# Altium project SAMA5D27-SOM1-EK1_ REVD1.PrjPcb (part 5 of 6)

## Sheet 08) Ethernet & USB.SchDoc
size B; CompanyName: Microchip Technology Inc.; Organization: Microchip Technology; Address1: 2355 West Chandler Blvd.; Address2: Chandler, AZ  85224; Address4: USA; DocumentNumber: 8; SheetNumber: 8; SheetTotal: 9; SheetTitle: **; Time: Time
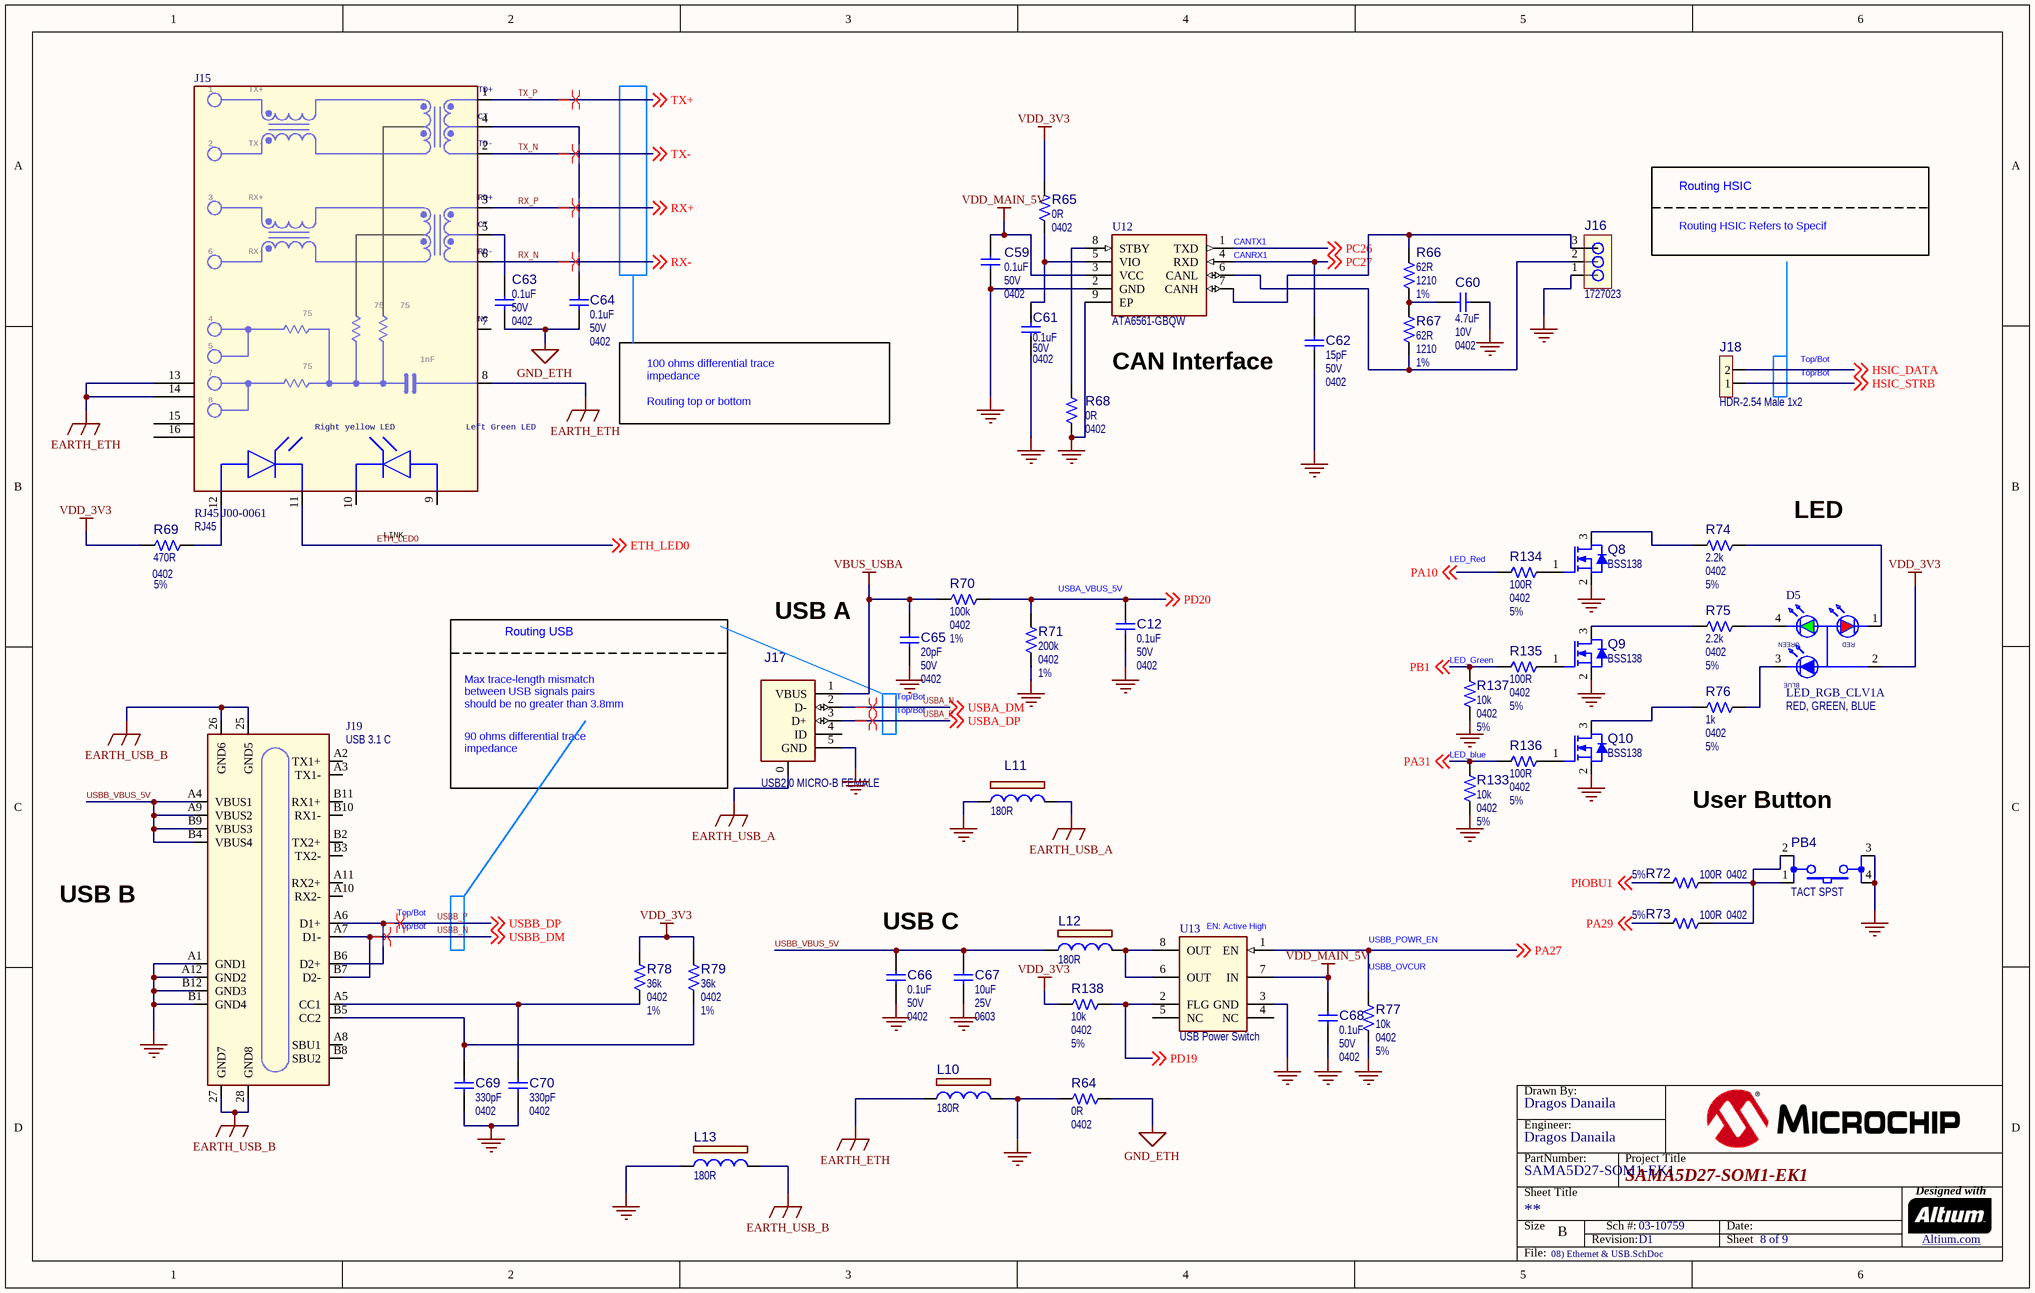
[diagram p7: 08) Ethernet & USB.SchDoc]

### Parts
(Parts that share a designator on the sheet are numbered #1, #2 ... from top to bottom, then left to right.)
?#8  (no value)  (graphical)
C12  value 0.1uF  Voltage: 50V  Package: 0402  [CAP_C_0402]  (hidden comment: Capacitor NP)
C59  value 0.1uF  Voltage: 50V  Package: 0402  [CAP_C_0402]  (hidden comment: Capacitor NP)
C60  value 4.7uF  Voltage: 10V  Package: 0402  [CAP_C_0402]  (hidden comment: Capacitor NP)
C61  value 0.1uF  Voltage: 50V  Package: 0402  [CAP_C_0402]  (hidden comment: Capacitor NP)
C62  value 15pF  Voltage: 50V  Package: 0402  [CAP_C_0402]  (hidden comment: Capacitor NP)
C63  value 0.1uF  Voltage: 50V  Package: 0402  [CAP_C_0402]  (hidden comment: Capacitor NP)
C64  value 0.1uF  Voltage: 50V  Package: 0402  [CAP_C_0402]  (hidden comment: Capacitor NP)
C65  value 20pF  Voltage: 50V  Package: 0402  [CAP_C_0402]  (hidden comment: Capacitor NP)
C66  value 0.1uF  Voltage: 50V  Package: 0402  [CAP_C_0402]  (hidden comment: Capacitor NP)
C67  value 10uF  Voltage: 25V  Package: 0603  [CAP_C_0603]  (hidden comment: Capacitor NP)
C68  value 0.1uF  Voltage: 50V  Package: 0402  [CAP_C_0402]  (hidden comment: Capacitor NP)
C69  value 330pF  Package: 0402  [CAP_C_0402]  (hidden comment: Capacitor NP)
C70  value 330pF  Package: 0402  [CAP_C_0402]  (hidden comment: Capacitor NP)
D5  LED_RGB_CLV1A  value RED, GREEN, BLUE  [PLCC-4_CLV1A-FKB]
J15  RJ45 J00-0061  value RJ45  [J00-0061NL_RJ45_connector]
J16  value 1727023  [CON_TERMINAL_3.81_1x3_TH_RA_PHO_1727023]  (hidden comment: CON TERM BLK 1x3 TH Mount)
J17  value USB2.0 MICRO-B FEMALE  [CON_USB_Micro-AB_SMD_TH_RA_FCI_10118194-0001LF]  (hidden comment: CON USB2.0 Mini_Micro)
J18  value HDR-2.54 Male 1x2  [HDR_M_2.54_1x2]  (hidden comment: Header 1x2)
J19  value USB 3.1 C  [CON USB3.1-C Female SMD RA 1054500101]  (hidden comment: CON USB3.1-C Female SMD RA)
L10  value 180R  [IND_C_0603]  (hidden comment: Ferrite Bead)
L11  value 180R  [IND_C_0603]  (hidden comment: Ferrite Bead)
L12  value 180R  [IND_C_0603]  (hidden comment: Ferrite Bead)
L13  value 180R  [IND_C_0603]  (hidden comment: Ferrite Bead)
PB4  value TACT SPST  [SW_SMD_6mmX6mm_TL3301]  (hidden comment: Switch 4 Pin)
Q8  value BSS138  [SOT-23-3]  (hidden comment: Transistor MOS-N GSD)
Q9  value BSS138  [SOT-23-3]  (hidden comment: Transistor MOS-N GSD)
Q10  value BSS138  [SOT-23-3]  (hidden comment: Transistor MOS-N GSD)
R64  value 0R  Package: 0402  [RES_C_0402]  (hidden comment: Resistor)
R65  value 0R  Package: 0402  [RES_C_0402]  (hidden comment: Resistor)
R66  value 62R  Package: 1210  Tolerance: 1%  [RES_C_1210]  (hidden comment: Resistor)
R67  value 62R  Package: 1210  Tolerance: 1%  [RES_C_1210]  (hidden comment: Resistor)
R68  value 0R  Package: 0402  [RES_C_0402]  (hidden comment: Resistor)
R69  value 470R  Package: 0402  Tolerance: 5%  [RES_C_0402]  (hidden comment: Resistor)
R70  value 100k  Package: 0402  Tolerance: 1%  [RES_C_0402]  (hidden comment: Resistor)
R71  value 200k  Package: 0402  Tolerance: 1%  [RES_C_0402]  (hidden comment: Resistor)
R72  value 100R  Package: 0402  Tolerance: 5%  [RES_C_0402]  (hidden comment: Resistor)
R73  value 100R  Package: 0402  Tolerance: 5%  [RES_C_0402]  (hidden comment: Resistor)
R74  value 2.2k  Package: 0402  Tolerance: 5%  [RES_C_0402]  (hidden comment: Resistor)
R75  value 2.2k  Package: 0402  Tolerance: 5%  [RES_C_0402]  (hidden comment: Resistor)
R76  value 1k  Package: 0402  Tolerance: 5%  [RES_C_0402]  (hidden comment: Resistor)
R77  value 10k  Package: 0402  Tolerance: 5%  [RES_C_0402]  (hidden comment: Resistor)
R78  value 36k  Package: 0402  Tolerance: 1%  [RES_C_0402]  (hidden comment: Resistor)
R79  value 36k  Package: 0402  Tolerance: 1%  [RES_C_0402]  (hidden comment: Resistor)
R133  value 10k  Package: 0402  Tolerance: 5%  [RES_C_0402]  (hidden comment: Resistor)
R134  value 100R  Package: 0402  Tolerance: 5%  [RES_C_0402]  (hidden comment: Resistor)
R135  value 100R  Package: 0402  Tolerance: 5%  [RES_C_0402]  (hidden comment: Resistor)
R136  value 100R  Package: 0402  Tolerance: 5%  [RES_C_0402]  (hidden comment: Resistor)
R137  value 10k  Package: 0402  Tolerance: 5%  [RES_C_0402]  (hidden comment: Resistor)
R138  value 10k  Package: 0402  Tolerance: 5%  [RES_C_0402]  (hidden comment: Resistor)
U12  value ATA6561-GBQW  [DFN-8_3x3_EP2.4X1.55]  (hidden comment: ATA6561 VDFN-8)
U13  value USB Power Switch  [SOIC-8]  (hidden comment: MCHP ANALOG POWER SWITCH 5.5V 0.7A MIC2025-1YM SOIC8)

### Nets
EARTH_ETH: J15.8(P8) J15.13(P13) J15.14(P14) L10.1
EARTH_USB_A: J17.0(SHLD) L11.2
EARTH_USB_B: J19.25(GND5) J19.26(GND6) J19.27(GND7) J19.28(GND8) L13.2
GND_ETH: C63.2 C64.2 R64.2
GND_POWER: C12.2 C59.2 C60.2 C61.2 C62.2 C65.2 C66.2 C67.2 C68.2 C69.2 C70.2 J16.1 J17.5(GND) J19.A1(GND1) J19.A12(GND2) J19.B1(GND4) J19.B12(GND3) L10.2 L11.1 L13.1 PB4.3 PB4.4 Q8.2(S) Q9.2(S) Q10.2(S) R64.1 R68.2 R71.2 R77.2 R133.2 R137.2 U12.2(GND) U12.9(EP) U13.3(GND)  [project net GND]
VBUS_USBA: C65.1 J17.1(VBUS) R70.1
VDD_3V3: D5.2(A) R65.1 R69.1 R78.1 R79.1 R138.1
VDD_MAIN_5V: C59.1 C68.1 U12.3(VCC) U13.7(IN)
ETH_LED0: J15.11(P11) ; off-sheet ETH_LED0
HSIC_DATA: J18.2 ; off-sheet HSIC_DATA
HSIC_STRB: J18.1 ; off-sheet HSIC_STRB
PA10: R134.1 ; off-sheet PA10
PA27: R77.1 U13.1(EN) ; off-sheet PA27
PA29: R73.1 ; off-sheet PA29
PA31: R133.1 R136.1 ; off-sheet PA31
PB1: R135.1 R137.1 ; off-sheet PB1
PC26: U12.1(TXD) ; off-sheet PC26
PC27: C62.1 U12.4(RXD) ; off-sheet PC27
PD19: R138.2 U13.2(FLG) ; off-sheet PD19
PD20: C12.1 R70.2 R71.1 ; off-sheet PD20
PIOBU1: R72.1 ; off-sheet PIOBU1
RX_N: J15.6(P6) ; off-sheet RX-  [also labelled RX-]
RX_P: J15.3(P3) ; off-sheet RX+  [also labelled RX+]
TX_N: J15.2(P2) ; off-sheet TX-  [also labelled TX-]
TX_P: J15.1(P1) ; off-sheet TX+  [also labelled TX+]
USBA_N: J17.2(D-) ; off-sheet USBA_DM  [also labelled USBA_DM]
USBA_P: J17.3(D+) ; off-sheet USBA_DP  [also labelled USBA_DP]
USBB_N: J19.A7(D1-) J19.B7(D2-) ; off-sheet USBB_DM  [also labelled USBB_DM]
USBB_P: J19.A6(D1+) J19.B6(D2+) ; off-sheet USBB_DP  [also labelled USBB_DP]
USBB_VBUS_5V: C66.1 C67.1 J19.A4(VBUS1) J19.A9(VBUS2) J19.B4(VBUS4) J19.B9(VBUS3) L12.1
NetC60_1: C60.1 R66.2 R67.1
NetC61_1: C61.1 R65.2 U12.5(VIO)
NetC63_1: C63.1 J15.5(P5)
NetC64_1: C64.1 J15.4(P4)
NetC69_1: C69.1 J19.B5(CC2) R79.2
NetC70_1: C70.1 J19.A5(CC1) R78.2
NetD5_1: D5.1(K1) R74.2
NetD5_3: D5.3(K3) R76.2
NetD5_4: D5.4(K2) R75.2
NetJ15_12: J15.12(P12) R69.2
NetJ16_2: J16.2 R67.2 U12.6(CANL)
NetJ16_3: J16.3 R66.1 U12.7(CANH)
NetL12_2: L12.2 U13.6(OUT) U13.8(OUT)
NetPB4_1: PB4.1 PB4.2 R72.2 R73.2
NetQ8_1: Q8.1(G) R134.2
NetQ8_3: Q8.3(D) R74.1
NetQ9_1: Q9.1(G) R135.2
NetQ9_3: Q9.3(D) R75.1
NetQ10_1: Q10.1(G) R136.2
NetQ10_3: Q10.3(D) R76.1
NetR68_1: R68.1 U12.8(STBY)

Not connected (* = marked no-connect by the designer): J15 7(P7) 9(P9) 10(P10) 15(P15) 16(P16); J17 4(ID); J19 A2(TX1+) A3(TX1-) A8(SBU1) A10(RX2-) A11(RX2+) B2(TX2+) B3(TX2-) B8(SBU2) B10(RX1-) B11(RX1+); U13 4(NC) 5(NC)

### Layout directives
differential pair: RX_N, RX_P, TX_N, TX_P, USBA_N, USBA_P, USBB_N, USBB_P

### Notes on the sheet
- Routing HSIC
- Routing HSIC Refers to Specif
- (near U12) CANTX1
- (near U12) CANRX1
- CAN Interface
- Top/Bot
- Routing top or bottom
- 100 ohms differential trace
  impedance
- (near J15) LINK
- (near R134) LED_Red
- LED
- Routing USB
- USB A
- USBA_VBUS_5V
- (near C65) Top/Bot
- LED_Green
- Max trace-length mismatch
  between USB signals pairs
  should be no greater than 3.8mm
- 90 ohms differential trace
  impedance
- (near R133) LED_blue
- (near PB4) User Button
- USB B
- USB C
- (near U13) EN: Active High
- USBB_POWR_EN
- (near R77) USBB_OVCUR
- Drawn By:
- Engineer:
- PartNumber:
- Project Title
- Sheet Title
- Size
- B
- Revision:
- Sch #:
- Date:
- Sheet
- Designed with
- Altium.com <http://go.altium.com/MicrochipLandingPage_Evaluation.html>
- File:
- (in symbol CON1658) TX+; TD+; CT; TX-; TD-; RX+; RD+; RX-; RD-; 75; NC; 1nF; Right yellow LED; Left Green LED
- (in symbol DIODE1214) GREEN; RED; BLUE

### Library data of the parts
?#8 = Title Block B
C12 C59 C61 C63 C64 C66 C68 = CAP1463: Capacitor; Manufacturer 1: TDK Corporation; Manufacturer Part Number 1: C1005X7R1H104K050BB; Description_: CAP CER 0.1uF 50V 10% X7R SMD 0402; Dev Tools Status: Production; Tolerance: 10%; Temperature Coeffcient: X7R; Type: Ceramic; Owner: Jamus Griego; Populated: YES; MCHP-ID: CAP1463; Revision: 1; Symbol: Capacitor NP; Status: MCL Design; ComponentLink1URL: https://chn-vm-apps.microchip.com/mchprepo/parts/Datasheets/TDKMLCCCapRange.pdf; ComponentLink1Description: SVN Datasheet; ComponentLink2URL: C:\ALTIUM_WORK\00001_MCHP-CDB\Datasheets\TDKMLCCCapRange.pdf; ComponentLink2Description: Local Datasheet; ComponentLink3URL: C:\ALTIUM_WORK\00001_MCHP-CDB\Library\LibraryRefs\Capacitor NP.SchLib; ComponentLink3Description: Open Symbol; ComponentLink4URL: C:\ALTIUM_WORK\00001_MCHP-CDB\Library\Footprints\CAP_C_0402.PcbLib; ComponentLink4Description: Open Footprint; ComponentLink5Description: Open Footprint 2; ComponentLink6Description: Open Footprint 3; ComponentLink7Description: Open Footprint 4; Operating Temperature: -55C to +125C; Category: Capacitor; Supplier 1: Digi-Key; Supplier Part Number 1: 445-5932-1-ND; Quantity Override: 1
C60 = CAP1684: Capacitor; Manufacturer 1: TDK Corporation; Manufacturer Part Number 1: C1005X5R1A475K050BC; Description_: CAP CER 4.7uF 10V 10% X5R SMD 0402; Dev Tools Status: Design; Tolerance: 10%; Temperature Coeffcient: X5R; Type: Ceramic; Owner: Jesus Aviles; Populated: YES; MCHP-ID: CAP1684; Revision: B; Symbol: Capacitor NP; Status: MCL Design; ComponentLink1Description: SVN Datasheet; ComponentLink2Description: Local Datasheet; ComponentLink3URL: C:\ALTIUM_WORK\00001_MCHP-CDB\Library\LibraryRefs\Capacitor NP.SchLib; ComponentLink3Description: Open Symbol; ComponentLink4URL: C:\ALTIUM_WORK\00001_MCHP-CDB\Library\Footprints\CAP_C_0402.PcbLib; ComponentLink4Description: Open Footprint; ComponentLink5Description: Open Footprint 2; ComponentLink6Description: Open Footprint 3; ComponentLink7Description: Open Footprint 4; Operating Temperature: -55C to 85C; Category: Capacitor; Supplier 1: Digi-Key; Supplier Part Number 1: 445-13820-1-ND; Quantity Override: 1
C62 = CAP0608: Capacitor; Manufacturer 1: Murata; Manufacturer Part Number 1: GRM1555C1H150JA01D; Description_: CAP CER 15pF 50V 5% NP0 SMD 0402; Dev Tools Status: Production; Tolerance: 5%; Temperature Coeffcient: NP0; Type: Ceramic; Populated: Yes; MCHP-ID: CAP0608; Revision: 1; Symbol: Capacitor NP; Status: MCL Design; ComponentLink1URL: https://chn-vm-apps.microchip.com/mchprepo/parts/Datasheets/L0005E.pdf; ComponentLink1Description: SVN Datasheet; ComponentLink2URL: C:\ALTIUM_WORK\00001_MCHP-CDB\Datasheets\L0005E.pdf; ComponentLink2Description: Local Datasheet; ComponentLink3URL: C:\ALTIUM_WORK\00001_MCHP-CDB\Library\LibraryRefs\Capacitor NP.SchLib; ComponentLink3Description: Open Symbol; ComponentLink4URL: C:\ALTIUM_WORK\00001_MCHP-CDB\Library\Footprints\CAP_C_0402.PcbLib; ComponentLink4Description: Open Footprint; ComponentLink5Description: Open Footprint 2; ComponentLink6Description: Open Footprint 3; ComponentLink7Description: Open Footprint 4; Operating Temperature: -55C to +125C; Category: Capacitor; Manufacturer 2: Murata; Manufacturer Part Number 2: GRM1555C1H150JZ01D; Supplier 1: Digi-Key; Supplier Part Number 1: 490-5888-2-ND; Supplier 2: Digi-Key; Supplier Part Number 2: 490-1280-1-ND; Quantity Override: 1
C65 = CAP0364: Capacitor; Manufacturer 1: Murata; Manufacturer Part Number 1: GRM1555C1H200JZ01D; Description_: CAP CER 20pF 50V 5% C0G SMD 0402; Dev Tools Status: Production; Tolerance: 5%; Temperature Coeffcient: C0G; Type: Ceramic; Populated: YES; MCHP-ID: CAP0364; Revision: 0; Symbol: Capacitor NP; Status: MCL Design; ComponentLink1URL: https://chn-vm-apps.microchip.com/mchprepo/parts/Datasheets/c02e.pdf; ComponentLink1Description: SVN Datasheet; ComponentLink2URL: C:\ALTIUM_WORK\00001_MCHP-CDB\Datasheets\c02e.pdf; ComponentLink2Description: Local Datasheet; ComponentLink3URL: C:\ALTIUM_WORK\00001_MCHP-CDB\Library\LibraryRefs\Capacitor NP.SchLib; ComponentLink3Description: Open Symbol; ComponentLink4URL: C:\ALTIUM_WORK\00001_MCHP-CDB\Library\Footprints\CAP_C_0402.PcbLib; ComponentLink4Description: Open Footprint; ComponentLink5Description: Open Footprint 2; ComponentLink6Description: Open Footprint 3; ComponentLink7Description: Open Footprint 4; Operating Temperature: -55C to +125C; Category: Capacitor; Supplier 1: Digi-Key; Supplier Part Number 1: 490-1282-1-ND; Quantity Override: 1
C67 = CAP1650: Capacitor; Manufacturer 1: TDK Corporation; Manufacturer Part Number 1: C1608X5R1E106M080AC; Description_: CAP CER 10uF 25V 20% X5R SMD 0603; Dev Tools Status: Design; Tolerance: 20%; Temperature Coeffcient: X5R; Type: Ceramic; Owner: Razvan Cristescu; Populated: YES; MCHP-ID: CAP1650; Revision: A; Symbol: Capacitor NP; Status: MCL Design; ComponentLink1URL: https://chn-vm-apps.microchip.com/mchprepo/parts/Datasheets/1913358.pdf; ComponentLink1Description: SVN Datasheet; ComponentLink2URL: C:\ALTIUM_WORK\00001_MCHP-CDB\Datasheets\1913358.pdf; ComponentLink2Description: Local Datasheet; ComponentLink3URL: C:\ALTIUM_WORK\00001_MCHP-CDB\Library\LibraryRefs\Capacitor NP.SchLib; ComponentLink3Description: Open Symbol; ComponentLink4URL: C:\ALTIUM_WORK\00001_MCHP-CDB\Library\Footprints\CAP_C_0603.PcbLib; ComponentLink4Description: Open Footprint; ComponentLink5Description: Open Footprint 2; ComponentLink6Description: Open Footprint 3; ComponentLink7Description: Open Footprint 4; Operating Temperature: -55C to +85C; Category: Capacitor; Supplier 1: Farnell; Supplier Part Number 1: 2521968; Quantity Override: 1
C69 C70 = CAP1469: Capacitor; Manufacturer 1: Murata Electronics North AmericaMurata Electronics North America; Manufacturer Part Number 1: GRM1555C1H331JA01D; Description_: CAP CER 330pF 50V 5% NP0 SMD 0402; Dev Tools Status: Production; Tolerance: 5%; Type: Ceramic; Owner: Jamus Griego; Populated: YES; MCHP-ID: CAP1469; Revision: 1; Symbol: Capacitor NP; Status: MCL Design; ComponentLink1URL: https://chn-vm-apps.microchip.com/mchprepo/parts/Datasheets/partnumbering_e_01.pdf; ComponentLink1Description: SVN Datasheet; ComponentLink2URL: C:\ALTIUM_WORK\00001_MCHP-CDB\Datasheets\partnumbering_e_01.pdf; ComponentLink2Description: Local Datasheet; ComponentLink3URL: C:\ALTIUM_WORK\00001_MCHP-CDB\Library\LibraryRefs\Capacitor NP.SchLib; ComponentLink3Description: Open Symbol; ComponentLink4URL: C:\ALTIUM_WORK\00001_MCHP-CDB\Library\Footprints\CAP_C_0402.PcbLib; ComponentLink4Description: Open Footprint; ComponentLink5Description: Open Footprint 2; ComponentLink6Description: Open Footprint 3; ComponentLink7Description: Open Footprint 4; Category: Capacitor; Supplier 1: Digi-Key; Supplier Part Number 1: 490-1295-1-ND; Quantity Override: 1
D5 = DIODE1214: Manufacturer 1: Cree Inc; Manufacturer Part Number 1: CLV1A-FKB-CK1N1G1BB7R4S3; Description_: DIO LED TRI RED, GREEN, BLUE 2V, 3.2V, 3.2V 20mA, 20mA, 20mA SMD 4-PLCC; Dev Tools Status: Design; Type: LED Tricolor; Forward Current: 20mA, 20mA, 20mA; Power: 130mW, 100mW, 100mW; Reverse Current: 10uA; Reverse Voltage: 5V; Owner: Randolph Sobrepena; Populated: YES; MCHP-ID: DIODE1214; Revision: 1; Symbol: LED_RGB_CLV1A; Status: MCL Design; Package: 4-PLCC; ComponentLink1URL: https://chn-vm-apps.microchip.com/mchprepo/parts/Datasheets/CLV1A-FKB_Rev5; ComponentLink1Description: SVN Datasheet; ComponentLink2URL: C:\ALTIUM_WORK\00001_MCHP-CDB\Datasheets\CLV1A-FKB_Rev5; ComponentLink2Description: Local Datasheet; ComponentLink3URL: C:\ALTIUM_WORK\00001_MCHP-CDB\Library\LibraryRefs\LED_RGB_CLV1A.SchLib; ComponentLink3Description: Open Symbol; ComponentLink4URL: C:\ALTIUM_WORK\00001_MCHP-CDB\Library\Footprints\PLCC-4_CLV1A-FKB.PcbLib; ComponentLink4Description: Open Footprint; ComponentLink5Description: Open Footprint 2; ComponentLink6Description: Open Footprint 3; ComponentLink7Description: Open Footprint 4; Operating Temperature: -40C - +100C; Category: Diode; Supplier 1: Digi-Key; Supplier Part Number 1: CLV1A-FKB-CK1N1G1BB7R4S3CT-ND; Quantity Override: 1
J15 = CON1658: CON MODULAR RJ45 ETHERNET J00-0061NL; Manufacturer 1: Pulse Electronics; Dev Tools Status: Design; Owner: Dragos Danaila; Populated: YES; MCHP-ID: CON1658; Revision: B; Symbol: RJ45 J00-0061; Description_: CON MODULAR RJ45 ETHERNET J00-0061NL; Status: MCL Design; ComponentLink1URL: https://chn-vm-apps.microchip.com/mchprepo/parts/Datasheets/J414.pdf; ComponentLink1Description: SVN Datasheet; ComponentLink2URL: C:\ALTIUM_WORK\00001_MCHP-CDB\Datasheets\J414.pdf; ComponentLink2Description: Local Datasheet; ComponentLink3URL: C:\ALTIUM_WORK\00001_MCHP-CDB\Library\LibraryRefs\RJ45 J00-0061.SchLib; ComponentLink3Description: Open Symbol; ComponentLink4URL: C:\ALTIUM_WORK\00001_MCHP-CDB\Library\Footprints\J00-0061NL_RJ45_connector.PcbLib; ComponentLink4Description: Open Footprint; ComponentLink5Description: Open Footprint 2; ComponentLink6Description: Open Footprint 3; ComponentLink7Description: Open Footprint 4; Type: Modular; Category: Connector; Manufacturer Part Number 1: J00-0061NL; Supplier 1: Digi-Key; Supplier Part Number 1: 553-1479-ND; Quantity Override: 1
J16 = CON1643: Manufacturer 1: Phoenix Contact; Description_: CON TERMINAL 3.81 1x3 TH RA PHO; Dev Tools Status: Design; Owner: Dragos Danaila; Voltage: 300V; Current: 13.5A; Populated: YES; MCHP-ID: CON1643; Revision: A; Symbol: CON TERM BLK 1x3 TH Mount; Status: MCL Design; ComponentLink1URL: https://chn-vm-apps.microchip.com/mchprepo/parts/Datasheets/1727023.pdf; ComponentLink1Description: SVN Datasheet; ComponentLink2URL: C:\ALTIUM_WORK\00001_MCHP-CDB\Datasheets\1727023.pdf; ComponentLink2Description: Local Datasheet; ComponentLink3URL: C:\ALTIUM_WORK\00001_MCHP-CDB\Library\LibraryRefs\CON TERM BLK 1x3 TH Mount.SchLib; ComponentLink3Description: Open Symbol; ComponentLink4URL: C:\ALTIUM_WORK\00001_MCHP-CDB\Library\Footprints\CON_TERMINAL_3.81_1x3_TH_RA_PHO_1727023.PcbLib; ComponentLink4Description: Open Footprint; ComponentLink5Description: Open Footprint 2; ComponentLink6Description: Open Footprint 3; ComponentLink7Description: Open Footprint 4; Type: Terminal Block; Category: Connector; Manufacturer Part Number 1: 1727023; Supplier 1: Digi-Key; Supplier Part Number 1: 277-1948-ND; Quantity Override: 1
J17 = CON1383: Connector USB Mini; Manufacturer 1: FCI; Manufacturer Part Number 1: 10118194-0001LF; Description_: CON USB2.0 MICRO-B FEMALE TH/SMD R/A; Dev Tools Status: Production; Populated: YES; Owner: Jamus Griego; MCHP-ID: CON1383; Revision: 1; Symbol: CON USB2.0 Mini_Micro; Status: MCL Design; ComponentLink1URL: https://chn-vm-apps.microchip.com/mchprepo/parts/Datasheets/10118194.pdf; ComponentLink1Description: SVN Datasheet; ComponentLink2URL: C:\ALTIUM_WORK\00001_MCHP-CDB\Datasheets\10118194.pdf; ComponentLink2Description: Local Datasheet; ComponentLink3URL: C:\ALTIUM_WORK\00001_MCHP-CDB\Library\LibraryRefs\CON USB2.0 Mini_Micro.SchLib; ComponentLink3Description: Open Symbol; ComponentLink4URL: C:\ALTIUM_WORK\00001_MCHP-CDB\Library\Footprints\CON_USB_Micro-AB_SMD_TH_RA_FCI_10118194-0001LF.PcbLib; ComponentLink4Description: Open Footprint; ComponentLink5Description: Open Footprint 2; ComponentLink6Description: Open Footprint 3; ComponentLink7Description: Open Footprint 4; Type: USB; Category: Connector; Supplier 1: Digi-Key; Supplier Part Number 1: 609-4618-1-ND; Quantity Override: 1; Manufacturer 2: YangMing; Manufacturer Part Number 2: YM-02-363-N05F; Supplier 2: Raynen; Supplier Part Number 2: YangMing YM-02-363-N05F
J18 = CON1108: Manufacturer 1: FCI; Manufacturer Part Number 1: 77311-118-02LF; Description_: CON HDR-2.54 Male 1x2 Gold 5.84MH TH VERT; Dev Tools Status: Production; Owner: Bogdan P (M91398); Populated: DNP; MCHP-ID: CON1108; Revision: 1; Symbol: Header 1x2; Status: MCL Design; ComponentLink1URL: https://chn-vm-apps.microchip.com/mchprepo/parts/Datasheets/77311.pdf; ComponentLink1Description: SVN Datasheet; ComponentLink2URL: C:\ALTIUM_WORK\00001_MCHP-CDB\Datasheets\77311.pdf; ComponentLink2Description: Local Datasheet; ComponentLink3URL: C:\ALTIUM_WORK\00001_MCHP-CDB\Library\LibraryRefs\Header 1x2.SchLib; ComponentLink3Description: Open Symbol; ComponentLink4URL: C:\ALTIUM_WORK\00001_MCHP-CDB\Library\Footprints\HDR_M_2.54_1x2.PcbLib; ComponentLink4Description: Open Footprint; ComponentLink5Description: Open Footprint 2; ComponentLink6Description: Open Footprint 3; ComponentLink7Description: Open Footprint 4; Type: Header 2.54mm; Category: Connector; Manufacturer 2: FCI; Manufacturer Part Number 2: 68001-202HLF; Manufacturer 3: FCI; Manufacturer Part Number 3: 68000-202HLF; Manufacturer 4: Samtec; Manufacturer Part Number 4: TSW-102-07-G-S; Manufacturer 5: Sullins; Manufacturer Part Number 5: PBC02SAAN; Manufacturer 6: SPC Technology; Manufacturer Part Number 6: SPC20481; Manufacturer 7: Samtec; Manufacturer Part Number 7: TSW-102-07-F-S; Manufacturer 8: Nextron; Manufacturer Part Number 8: R-211-0211-0021-000; Manufacturer 9: Samtec; Manufacturer Part Number 9: TSW-102-07-S-S; Supplier 1: Digi-Key; Supplier Part Number 1: 609-4434-ND; Supplier 2: Digi-Key; Supplier Part Number 2: 609-3469-ND; Supplier 3: Digi-Key; Supplier Part Number 3: 609-3502-ND; Supplier 4: Digi-Key; Supplier Part Number 4: SAM1029-02-ND; Supplier 5: Digi-Key; Supplier Part Number 5: S1011E-02-ND; Supplier 6: Newark; Supplier Part Number 6: 93K5734; Supplier 7: Newark; Supplier Part Number 7: 79P3146; Supplier 8: Raynen; Supplier Part Number 8: R-211-0211-0021-000; Supplier 9: Samtec; Supplier Part Number 9: TSW-102-07-S-S; Quantity Override: 1
J19 = CON1642: Manufacturer 1: Molex, LLC; Manufacturer Part Number 1: 1054500101; Dev Tools Status: Design; Owner: Dragos Danaila; Voltage: 30V; Current: 0.25A; Populated: YES; MCHP-ID: CON1642; Revision: A; Symbol: CON USB3.1-C Female SMD RA; Description_: CON USB3.1-C Female SMD RA; Status: MCL Design; ComponentLink1URL: https://chn-vm-apps.microchip.com/mchprepo/parts/Datasheets/PS-105448-001.pdf; ComponentLink1Description: SVN Datasheet; ComponentLink2URL: C:\ALTIUM_WORK\00001_MCHP-CDB\Datasheets\PS-105448-001.pdf; ComponentLink2Description: Local Datasheet; ComponentLink3URL: C:\ALTIUM_WORK\00001_MCHP-CDB\Library\LibraryRefs\CON USB3.1-C Female SMD RA.SchLib; ComponentLink3Description: Open Symbol; ComponentLink4URL: C:\ALTIUM_WORK\00001_MCHP-CDB\Library\Footprints\CON USB3.1-C Female SMD RA 1054500101.PcbLib; ComponentLink4Description: Open Footprint; ComponentLink5Description: Open Footprint 2; ComponentLink6Description: Open Footprint 3; ComponentLink7Description: Open Footprint 4; Type: USB; Category: Connector; Supplier 1: Digi-Key; Supplier Part Number 1: WM12856CT-ND; Quantity Override: 1
L10-L13 = IND1453: FERRITE 180R 1.5A SMD 0603; Manufacturer 1: Murata Electronics North America; Manufacturer Part Number 1: BLM18PG181SN1D; Dev Tools Status: Design; Owner: Dragos Danaila; DCR: 0.09R; Test Frequency: 100MHz; Populated: YES; MCHP-ID: IND1453; Revision: A; Symbol: Ferrite Bead; Description_: FERRITE 180R 1.5A SMD 0603; Status: MCL Design; ComponentLink1URL: https://chn-vm-apps.microchip.com/mchprepo/parts/Datasheets/ENFA0003.pdf; ComponentLink1Description: SVN Datasheet; ComponentLink2URL: C:\ALTIUM_WORK\00001_MCHP-CDB\Datasheets\ENFA0003.pdf; ComponentLink2Description: Local Datasheet; ComponentLink3URL: C:\ALTIUM_WORK\00001_MCHP-CDB\Library\LibraryRefs\Ferrite Bead.SchLib; ComponentLink3Description: Open Symbol; ComponentLink4URL: C:\ALTIUM_WORK\00001_MCHP-CDB\Library\Footprints\IND_C_0603.PcbLib; ComponentLink4Description: Open Footprint; ComponentLink5Description: Open Footprint 2; ComponentLink6Description: Open Footprint 3; ComponentLink7Description: Open Footprint 4; Operating Temperature: -55C to +125C; Package: 0603; Type: Ferrite Bead; Category: Inductor; Saturation Current: 1.5A; Supplier 1: Digi-Key; Supplier Part Number 1: 490-5263-1-ND; Quantity Override: 1
PB4 = SWITCH0003: Switch; Manufacturer 1: E-Switch; Manufacturer Part Number 1: TL3301NF260QG/TR; Description_: SWITCH TACT SPST 12V 50mA TL3301NF160QG/TR SMD; Dev Tools Status: Production; Voltage: 12V; Current: 50mA; Populated: Yes; MCHP-ID: SWITCH0003; Revision: 2; Symbol: Switch 4 Pin; Status: MCL Design; ComponentLink1URL: https://chn-vm-apps.microchip.com/mchprepo/parts/Datasheets/TL3301.pdf; ComponentLink1Description: SVN Datasheet; ComponentLink2URL: C:\ALTIUM_WORK\00001_MCHP-CDB\Datasheets\TL3301.pdf; ComponentLink2Description: Local Datasheet; ComponentLink3URL: C:\ALTIUM_WORK\00001_MCHP-CDB\Library\LibraryRefs\Switch 4 Pin.SchLib; ComponentLink3Description: Open Symbol; ComponentLink4URL: C:\ALTIUM_WORK\00001_MCHP-CDB\Library\Footprints\SW_SMD_6mmX6mm_TL3301.PcbLib; ComponentLink4Description: Open Footprint; ComponentLink5Description: Open Footprint 2; ComponentLink6Description: Open Footprint 3; ComponentLink7Description: Open Footprint 4; Operating Temperature: -20C to +70C; Category: Switch; Type: Tactile; Manufacturer 2: E-Switch; Manufacturer Part Number 2: TL3301NF260QG; Manufacturer 3: E-Switch; Manufacturer Part Number 3: TL3301NF160QG/TR; Manufacturer 4: OMRON; Manufacturer Part Number 4: B3S-1000P; Manufacturer 5: OMRON; Manufacturer Part Number 5: B3S-1000; Manufacturer 6: OMRON; Manufacturer Part Number 6: B3S-1002P; Manufacturer 7: OMRON; Manufacturer Part Number 7: B3S-1002; Manufacturer 8: Switech Electronics Co. Ltd; Manufacturer Part Number 8: TS2A-043C-G9; Supplier 1: Digi-Key; Supplier Part Number 1: EG1868CT-ND; Supplier 2: Digi-Key; Supplier Part Number 2: EG1868TR-ND; Supplier 3: Digi-Key; Supplier Part Number 3: EG1867CT-ND; Supplier 4: Digi-Key; Supplier Part Number 4: SW836CT-ND; Supplier 5: Digi-Key; Supplier Part Number 5: SW415-ND; Supplier 6: Digi-Key; Supplier Part Number 6: SW837CT-ND; Supplier 7: Digi-Key; Supplier Part Number 7: SW416-ND; Supplier 8: Raynen; Supplier Part Number 8: SWIT00025C01; Quantity Override: 1
Q8-Q10 = TRA1147: Transistor MOS; Manufacturer 1: Fairchild; Description_: TRANS FET N-CH BSS138 50V 220mA 360mW SOT-23; Dev Tools Status: Design; Type: FET; Current: 220mA; Drain to Source Voltage: 50V; Gate to Source Voltage: 1.3V; Power: 360mW; Owner: Razvan Cristescu; Populated: YES; MCHP-ID: TRA1147; Revision: A; Symbol: Transistor MOS-N GSD; Status: MCL Design; Package: SOT-23-3; ComponentLink1URL: https://chn-vm-apps.microchip.com/mchprepo/parts/Datasheets/2163920.pdf; ComponentLink1Description: SVN Datasheet; ComponentLink2URL: C:\ALTIUM_WORK\00001_MCHP-CDB\Datasheets\2163920.pdf; ComponentLink2Description: Local Datasheet; ComponentLink3URL: C:\ALTIUM_WORK\00001_MCHP-CDB\Library\LibraryRefs\Transistor MOS-N GSD.SchLib; ComponentLink3Description: Open Symbol; ComponentLink4URL: C:\ALTIUM_WORK\00001_MCHP-CDB\Library\Footprints\SOT-23-3.PcbLib; ComponentLink4Description: Open Footprint; ComponentLink5Description: Open Footprint 2; ComponentLink6Description: Open Footprint 3; ComponentLink7Description: Open Footprint 4; Operating Temperature: -55C to +150C; Category: Transistor; Voltage: 50V; Manufacturer Part Number 1: BSS138; Supplier 1: Farnell; Supplier Part Number 1: 9845330; Quantity Override: 1
R64 R65 R68 = RSMT0730: Manufacturer 1: Panasonic; Manufacturer Part Number 1: ERJ-2GE0R00X; Description_: RES TKF 0R SMD 0402; Dev Tools Status: Production; Power: 1/10W; Populated: Yes; MCHP-ID: RSMT0730; Revision: 2; Symbol: Resistor; Status: MCL Design; ComponentLink1URL: https://chn-vm-apps.microchip.com/mchprepo/parts/Datasheets/AOA0000CE1.pdf; ComponentLink1Description: SVN Datasheet; ComponentLink2URL: C:\ALTIUM_WORK\00001_MCHP-CDB\Datasheets\AOA0000CE1.pdf; ComponentLink2Description: Local Datasheet; ComponentLink3URL: C:\ALTIUM_WORK\00001_MCHP-CDB\Library\LibraryRefs\Resistor.SchLib; ComponentLink3Description: Open Symbol; ComponentLink4URL: C:\ALTIUM_WORK\00001_MCHP-CDB\Library\Footprints\RES_C_0402.PcbLib; ComponentLink4Description: Open Footprint; ComponentLink5Description: Open Footprint 2; ComponentLink6Description: Open Footprint 3; ComponentLink7Description: Open Footprint 4; Operating Temperature: -55C to +155C; Category: Resistor; Type: RES SMD; Composition: TKF; Manufacturer 2: Vishay; Manufacturer Part Number 2: CRCW04020000Z0ED; Supplier 1: Digi-Key; Supplier Part Number 1: P0.0JCT-ND; Supplier 2: Digi-Key; Supplier Part Number 2: 541-0.0JTR-ND; Quantity Override: 1
R66 R67 = RSMT1214: Manufacturer 1: Panasonic Electronic Components; Manufacturer Part Number 1: ERJ-U14F62R0U; Description_: RES TKF 62R 1% 1/2W SMD 1210; Dev Tools Status: Design; Voltage: 200V; Temperature Coeffcient: 100ppm/C; Power: 1/2W; Owner: Dragos Danaila; Populated: YES; MCHP-ID: RSMT1214; Revision: 1; Symbol: Resistor; Status: MCL Design; ComponentLink1URL: https://chn-vm-apps.microchip.com/mchprepo/parts/Datasheets/Panasonic_resistors_ERJU_ERJS.pdf; ComponentLink1Description: SVN Datasheet; ComponentLink2URL: C:\ALTIUM_WORK\00001_MCHP-CDB\Datasheets\Panasonic_resistors_ERJU_ERJS.pdf; ComponentLink2Description: Local Datasheet; ComponentLink3URL: C:\ALTIUM_WORK\00001_MCHP-CDB\Library\LibraryRefs\Resistor.SchLib; ComponentLink3Description: Open Symbol; ComponentLink4URL: C:\ALTIUM_WORK\00001_MCHP-CDB\Library\Footprints\RES_C_1210.PcbLib; ComponentLink4Description: Open Footprint; ComponentLink5Description: Open Footprint 2; ComponentLink6Description: Open Footprint 3; ComponentLink7Description: Open Footprint 4; Operating Temperature: -55C to +155C; Category: Resistor; Type: RES SMD; Composition: TKF; Supplier 1: Mouser; Supplier Part Number 1: 667-ERJ-U14F62R0U; Quantity Override: 1
R69 = RSMT1037: Manufacturer 1: Yageo; Manufacturer Part Number 1: RC0402JR-07470RL; Description_: RES TKF 470R 5% 1/16W SMD 0402; Dev Tools Status: Production; Voltage: 50V; Temperature Coeffcient: 100ppm/C; Power: 1/16W; Owner: Sompoch Loboonlert; Populated: Yes; MCHP-ID: RSMT1037; Revision: 2; Symbol: Resistor; Status: MCL Design; ComponentLink1URL: https://chn-vm-apps.microchip.com/mchprepo/parts/Datasheets/PYu-RC0402_51_RoHS_L_6.pdf; ComponentLink1Description: SVN Datasheet; ComponentLink2URL: C:\ALTIUM_WORK\00001_MCHP-CDB\Datasheets\PYu-RC0402_51_RoHS_L_6.pdf; ComponentLink2Description: Local Datasheet; ComponentLink3URL: C:\ALTIUM_WORK\00001_MCHP-CDB\Library\LibraryRefs\Resistor.SchLib; ComponentLink3Description: Open Symbol; ComponentLink4URL: C:\ALTIUM_WORK\00001_MCHP-CDB\Library\Footprints\RES_C_0402.PcbLib; ComponentLink4Description: Open Footprint; ComponentLink5Description: Open Footprint 2; ComponentLink6Description: Open Footprint 3; ComponentLink7Description: Open Footprint 4; Operating Temperature: -55C to +155C; Category: Resistor; Type: RES SMD; Composition: TKF; Supplier 1: Digi-Key; Supplier Part Number 1: 311-470JRCT-ND; Quantity Override: 1
R70 = RES1011: Manufacturer 1: Panasonic; Manufacturer Part Number 1: ERJ-2RKF1003X; Description_: RES TKF 100k 1% 1/10W SMD 0402; Dev Tools Status: Production; Voltage: 50V; Temperature Coeffcient: 100ppm/C; Power: 1/10W; Owner: Tad Ahlvers; Populated: YES; MCHP-ID: RES1011; Revision: 1; Symbol: Resistor; Status: MCL Design; ComponentLink1URL: https://chn-vm-apps.microchip.com/mchprepo/parts/Datasheets/AOA0000CE2.pdf; ComponentLink1Description: SVN Datasheet; ComponentLink2URL: C:\ALTIUM_WORK\00001_MCHP-CDB\Datasheets\AOA0000CE2.pdf; ComponentLink2Description: Local Datasheet; ComponentLink3URL: C:\ALTIUM_WORK\00001_MCHP-CDB\Library\LibraryRefs\Resistor.SchLib; ComponentLink3Description: Open Symbol; ComponentLink4URL: C:\ALTIUM_WORK\00001_MCHP-CDB\Library\Footprints\RES_C_0402.PcbLib; ComponentLink4Description: Open Footprint; ComponentLink5Description: Open Footprint 2; ComponentLink6Description: Open Footprint 3; ComponentLink7Description: Open Footprint 4; Operating Temperature: -55C to +125C; Category: Resistor; Type: RES SMD; Composition: TKF; Supplier 1: Digi-Key; Supplier Part Number 1: P100KLCT-ND; Quantity Override: 1
R71 = RES1424: Manufacturer 1: Panasonic; Manufacturer Part Number 1: ERJ-2RKF2003X; Description_: RES TKF 200k 1% 1/10W SMD 0402; Dev Tools Status: Production; Voltage: 50V; Temperature Coeffcient: 100ppm/C; Power: 1/10W; Owner: Tad Ahlvers; Populated: YES; MCHP-ID: RES1424; Revision: 1; Symbol: RESISTOR; Status: MCL Design; ComponentLink1URL: https://chn-vm-apps.microchip.com/mchprepo/parts/Datasheets/AOA0000CE2.pdf; ComponentLink1Description: SVN Datasheet; ComponentLink2URL: C:\ALTIUM_WORK\00001_MCHP-CDB\Datasheets\AOA0000CE2.pdf; ComponentLink2Description: Local Datasheet; ComponentLink3URL: C:\ALTIUM_WORK\00001_MCHP-CDB\Library\LibraryRefs\RESISTOR.SchLib; ComponentLink3Description: Open Symbol; ComponentLink4URL: C:\ALTIUM_WORK\00001_MCHP-CDB\Library\Footprints\RES_C_0402.PcbLib; ComponentLink4Description: Open Footprint; ComponentLink5Description: Open Footprint 2; ComponentLink6Description: Open Footprint 3; ComponentLink7Description: Open Footprint 4; Operating Temperature: -55C to +125C; Category: Resistor; Type: RES SMD; Composition: TKF; Supplier 1: Digi-Key; Supplier Part Number 1: P200KLCT-ND; Quantity Override: 1
R72 = RSMT1038: Manufacturer 1: Yageo; Manufacturer Part Number 1: RC0402JR-07100RL; Description_: RES TKF 100R 5% 1/16W SMD 0402; Dev Tools Status: Production; Voltage: 50V; Temperature Coeffcient: 100ppm/C; Power: 1/16W; Owner: Sompoch Loboonlert; Populated: DNP; MCHP-ID: RSMT1038; Revision: 2; Symbol: Resistor; Status: MCL Design; ComponentLink1URL: https://chn-vm-apps.microchip.com/mchprepo/parts/Datasheets/PYu-RC0402_51_RoHS_L_6.pdf; ComponentLink1Description: SVN Datasheet; ComponentLink2URL: C:\ALTIUM_WORK\00001_MCHP-CDB\Datasheets\PYu-RC0402_51_RoHS_L_6.pdf; ComponentLink2Description: Local Datasheet; ComponentLink3URL: C:\ALTIUM_WORK\00001_MCHP-CDB\Library\LibraryRefs\Resistor.SchLib; ComponentLink3Description: Open Symbol; ComponentLink4URL: C:\ALTIUM_WORK\00001_MCHP-CDB\Library\Footprints\RES_C_0402.PcbLib; ComponentLink4Description: Open Footprint; ComponentLink5Description: Open Footprint 2; ComponentLink6Description: Open Footprint 3; ComponentLink7Description: Open Footprint 4; Operating Temperature: -55C to +155C; Category: Resistor; Type: RES SMD; Composition: TKF; Supplier 1: Digi-Key; Supplier Part Number 1: 311-100JRCT-ND; Quantity Override: 1
R73 R134-R136 = RSMT1038: Manufacturer 1: Yageo; Manufacturer Part Number 1: RC0402JR-07100RL; Description_: RES TKF 100R 5% 1/16W SMD 0402; Dev Tools Status: Production; Voltage: 50V; Temperature Coeffcient: 100ppm/C; Power: 1/16W; Owner: Sompoch Loboonlert; Populated: Yes; MCHP-ID: RSMT1038; Revision: 2; Symbol: Resistor; Status: MCL Design; ComponentLink1URL: https://chn-vm-apps.microchip.com/mchprepo/parts/Datasheets/PYu-RC0402_51_RoHS_L_6.pdf; ComponentLink1Description: SVN Datasheet; ComponentLink2URL: C:\ALTIUM_WORK\00001_MCHP-CDB\Datasheets\PYu-RC0402_51_RoHS_L_6.pdf; ComponentLink2Description: Local Datasheet; ComponentLink3URL: C:\ALTIUM_WORK\00001_MCHP-CDB\Library\LibraryRefs\Resistor.SchLib; ComponentLink3Description: Open Symbol; ComponentLink4URL: C:\ALTIUM_WORK\00001_MCHP-CDB\Library\Footprints\RES_C_0402.PcbLib; ComponentLink4Description: Open Footprint; ComponentLink5Description: Open Footprint 2; ComponentLink6Description: Open Footprint 3; ComponentLink7Description: Open Footprint 4; Operating Temperature: -55C to +155C; Category: Resistor; Type: RES SMD; Composition: TKF; Supplier 1: Digi-Key; Supplier Part Number 1: 311-100JRCT-ND; Quantity Override: 1
R74 R75 = RES1020: Manufacturer 1: Vishay Dale; Manufacturer Part Number 1: CRCW04022K20JNED; Description_: RES TKF 2.2k 5% 1/16W SMD 0402; Dev Tools Status: Production; Voltage: 50V; Temperature Coeffcient: 200ppm/C; Power: 1/16W; Owner: Tad Ahlvers; Populated: YES; MCHP-ID: RES1020; Revision: 1; Symbol: Resistor; Status: MCL Design; ComponentLink1URL: https://chn-vm-apps.microchip.com/mchprepo/parts/Datasheets/dcrcwe3.pdf; ComponentLink1Description: SVN Datasheet; ComponentLink2URL: C:\ALTIUM_WORK\00001_MCHP-CDB\Datasheets\dcrcwe3.pdf; ComponentLink2Description: Local Datasheet; ComponentLink3URL: C:\ALTIUM_WORK\00001_MCHP-CDB\Library\LibraryRefs\Resistor.SchLib; ComponentLink3Description: Open Symbol; ComponentLink4URL: C:\ALTIUM_WORK\00001_MCHP-CDB\Library\Footprints\RES_C_0402.PcbLib; ComponentLink4Description: Open Footprint; ComponentLink5Description: Open Footprint 2; ComponentLink6Description: Open Footprint 3; ComponentLink7Description: Open Footprint 4; Operating Temperature: -55C to +155C; Category: Resistor; Type: RES SMD; Composition: TKF; Supplier 1: Digi-Key; Supplier Part Number 1: 541-2.2KJCT-ND; Quantity Override: 1
R76 = RSMT0316: Manufacturer 1: Panasonic; Manufacturer Part Number 1: ERJ-2GEJ102X; Description_: RES TKF 1k 5% 1/16W SMD 0402; Dev Tools Status: Production; Voltage: 50V; Temperature Coeffcient: 200ppm/C; Power: 1/16W; Owner: Tad Ahlvers; Populated: YES; MCHP-ID: RSMT0316; Revision: 1; Symbol: Resistor; Status: MCL Design; ComponentLink1URL: https://chn-vm-apps.microchip.com/mchprepo/parts/Datasheets/AOA0000CE1.pdf; ComponentLink1Description: SVN Datasheet; ComponentLink2URL: C:\ALTIUM_WORK\00001_MCHP-CDB\Datasheets\AOA0000CE1.pdf; ComponentLink2Description: Local Datasheet; ComponentLink3URL: C:\ALTIUM_WORK\00001_MCHP-CDB\Library\LibraryRefs\Resistor.SchLib; ComponentLink3Description: Open Symbol; ComponentLink4URL: C:\ALTIUM_WORK\00001_MCHP-CDB\Library\Footprints\RES_C_0402.PcbLib; ComponentLink4Description: Open Footprint; ComponentLink5Description: Open Footprint 2; ComponentLink6Description: Open Footprint 3; ComponentLink7Description: Open Footprint 4; Operating Temperature: -55C to +155C; Category: Resistor; Type: RES SMD; Composition: TKF; Supplier 1: Digi-Key; Supplier Part Number 1: P1.0KJCT-ND; Quantity Override: 1
R77 R133 R137 R138 = RSMT0439: Manufacturer 1: Vishay; Manufacturer Part Number 1: CRCW040210K0JNED; Description_: RES TKF 10k 5% 1/16W SMD 0402; Dev Tools Status: Production; Voltage: 50V; Temperature Coeffcient: 100ppm/C; Power: 1/16W; Populated: Yes; MCHP-ID: RSMT0439; Revision: 1; Symbol: Resistor; Status: MCL Design; ComponentLink1URL: https://chn-vm-apps.microchip.com/mchprepo/parts/Datasheets/PYu-RC0402_51_RoHS_L_6.pdf; ComponentLink1Description: SVN Datasheet; ComponentLink2URL: C:\ALTIUM_WORK\00001_MCHP-CDB\Datasheets\PYu-RC0402_51_RoHS_L_6.pdf; ComponentLink2Description: Local Datasheet; ComponentLink3URL: C:\ALTIUM_WORK\00001_MCHP-CDB\Library\LibraryRefs\Resistor.SchLib; ComponentLink3Description: Open Symbol; ComponentLink4URL: C:\ALTIUM_WORK\00001_MCHP-CDB\Library\Footprints\RES_C_0402.PcbLib; ComponentLink4Description: Open Footprint; ComponentLink5Description: Open Footprint 2; ComponentLink6Description: Open Footprint 3; ComponentLink7Description: Open Footprint 4; Operating Temperature: -55C to +155C; Category: Resistor; Type: RES SMD; Composition: TKF; Manufacturer 2: Yageo; Manufacturer Part Number 2: RC0402JR-0710KL; Supplier 1: Digi-Key; Supplier Part Number 1: 541-10KJCT-ND; Supplier 2: Digi-Key; Supplier Part Number 2: 311-10KJRCT-ND; Quantity Override: 1
R78 R79 = RSMT1212: Manufacturer 1: Vishay Dale; Manufacturer Part Number 1: CRCW040236K0FKED; Description_: RES TKF 36k 1% 1/16W SMD 0402; Dev Tools Status: Design; Voltage: 50V; Temperature Coeffcient: 100ppm/C; Power: 1/16W; Owner: Dragos Danaila; Populated: YES; MCHP-ID: RSMT1212; Revision: A; Symbol: Resistor; Status: MCL Design; ComponentLink1URL: https://chn-vm-apps.microchip.com/mchprepo/parts/Datasheets/dcrcwe3.pdf; ComponentLink1Description: SVN Datasheet; ComponentLink2URL: C:\ALTIUM_WORK\00001_MCHP-CDB\Datasheets\dcrcwe3.pdf; ComponentLink2Description: Local Datasheet; ComponentLink3URL: C:\ALTIUM_WORK\00001_MCHP-CDB\Library\LibraryRefs\Resistor.SchLib; ComponentLink3Description: Open Symbol; ComponentLink4URL: C:\ALTIUM_WORK\00001_MCHP-CDB\Library\Footprints\RES_C_0402.PcbLib; ComponentLink4Description: Open Footprint; ComponentLink5Description: Open Footprint 2; ComponentLink6Description: Open Footprint 3; ComponentLink7Description: Open Footprint 4; Operating Temperature: -55C to +155C; Category: Resistor; Type: RES SMD; Composition: TKF; Supplier 1: Digi-Key; Supplier Part Number 1: 541-36.0KLCT-ND; Quantity Override: 1
U12 = MIC7236: MCHP INTERFACE CAN ATA6561-GBQW VDFN-8; Manufacturer 1: Microchip Technology; MAPS Description: CAN TRX with VIO PIN (DFN8); Dev Tools Status: Design; Owner: Alexandru Chiser - M19201; MPC: 77A09YQ8BC07; LeadContent: Pb-FREE; PackingMedia: T/R; Stage: REL; LeadCount: 8; PackageWidth: 3x3x0.9mm; ForceMinOrderQtyMult: True; MinOrderQty: 6000; TempRange: -40C to +125C; tblDeviceFamilyID: 11070; OperatingVoltageMin: 4.5; OperatingVoltageMax: 5.5; StandbyCurrentMax: 0; Populated: YES; MCHP-ID: MIC7236; Description_: MCHP INTERFACE CAN ATA6561-GBQW VDFN-8; Symbol: ATA6561 VDFN-8; Type: CAN; Status: MCL Design; Revision: A; Category: MCHP-Interface; ComponentLink1URL: http://www.microchip.com/wwwproducts/Devices.aspx?product=ATA6561; ComponentLink1Description: SVN Datasheet; ComponentLink2URL: C:\ALTIUM_WORK\00001_MCHP-CDB\Datasheets\Atmel-9288-CAN-Networking-ATA6560-ATA6561_Datasheet.pdf; ComponentLink2Description: Local Datasheet; ComponentLink3URL: C:\ALTIUM_WORK\00001_MCHP-CDB\Library\LibraryRefs\ATA6561 VDFN-8.SchLib; ComponentLink3Description: Open Symbol; ComponentLink4URL: C:\ALTIUM_WORK\00001_MCHP-CDB\Library\Footprints\DFN-8_3x3_EP2.4X1.55.PcbLib; ComponentLink4Description: Open Footprint; ComponentLink5Description: Open Footprint 2; ComponentLink6Description: Open Footprint 3; ComponentLink7Description: Open Footprint 4; Manufacturer Part Number 1: ATA6561-GBQW; Supplier 1: Digi-Key; Supplier Part Number 1: 1611-ATA6561-GBQWCT-ND; IntroductionDate: 2017-02-03; PackageType: VDFN; OperatingCurrentMax: 0; BitrateMax: 0; PropDelayMax: 0; Masks: 0; Filters: 0; Quantity Override: 1
U13 = MIC7234: Manufacturer 1: Microchip Technology; Dev Tools Status: Design; Owner: Dragos Danaila; Populated: YES; MCHP-ID: MIC7234; Description_: MCHP ANALOG POWER SWITCH 5.5V 0.7A MIC2025-1YM SOIC8; Symbol: MCHP ANALOG POWER SWITCH 5.5V 0.7A MIC2025-1YM SOIC8; Type: Power Switch; Status: MCL Design; Revision: A; Category: MCHP-Analog; ComponentLink1Description: SVN Datasheet; ComponentLink2URL: C:\ALTIUM_WORK\00001_MCHP-CDB\Datasheets\MIC2025_2075.pdf; ComponentLink2Description: Local Datasheet; ComponentLink3URL: C:\ALTIUM_WORK\00001_MCHP-CDB\Library\LibraryRefs\MCHP ANALOG POWER SWITCH 5.5V 0.7A MIC2025-1YM SOIC8.SchLib; ComponentLink3Description: Open Symbol; ComponentLink4URL: C:\ALTIUM_WORK\00001_MCHP-CDB\Library\Footprints\SOIC-8.PcbLib; ComponentLink4Description: Open Footprint; ComponentLink5Description: Open Footprint 2; ComponentLink6Description: Open Footprint 3; ComponentLink7Description: Open Footprint 4; Manufacturer Part Number 1: MIC2025-1YM; Supplier 1: Digi-Key; Supplier Part Number 1: 576-1057-ND; Quantity Override: 1